# EAGLE design vfd_driver (EAGLE 7.1.0)
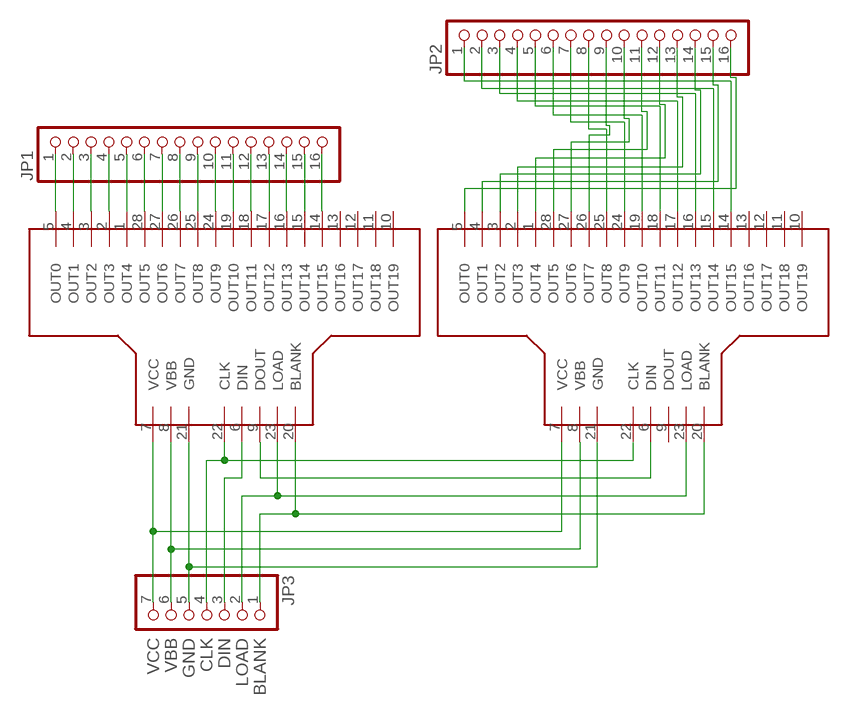
[diagram p0: schematic, sheet 1]

## Parts
JP1  PINHD-1X16  [1X16]
JP2  PINHD-1X16  [1X16]
JP3  PINHD-1X7  [1X07]
U$1  MAX6921/31  [TSSOP-28]
U$2  MAX6921/31  [TSSOP-28]

## Nets
BLANK: JP3.1 U$1.20(BLANK) U$2.20(BLANK)
CLK: JP3.4 U$1.22(CLK) U$2.22(CLK)
DIN: JP3.3 U$1.6(DIN)
DINOUT: U$1.9(DOUT) U$2.6(DIN)
GND: JP3.5 U$1.21(GND) U$2.21(GND)
LOAD: JP3.2 U$1.23(LOAD) U$2.23(LOAD)
N$1: JP2.1 U$2.14(OUT15)
N$2: JP2.2 U$2.15(OUT14)
N$3: JP2.3 U$2.16(OUT13)
N$4: JP2.4 U$2.17(OUT12)
N$5: JP2.5 U$2.18(OUT11)
N$6: JP2.6 U$2.19(OUT10)
N$7: JP2.7 U$2.24(OUT9)
N$8: JP2.8 U$2.25(OUT8)
N$9: JP2.9 U$2.26(OUT7)
N$10: JP2.10 U$2.27(OUT6)
N$11: JP2.11 U$2.28(OUT5)
N$12: JP2.12 U$2.1(OUT4)
N$13: JP2.13 U$2.2(OUT3)
N$14: JP2.14 U$2.3(OUT2)
N$15: JP2.15 U$2.4(OUT1)
N$16: JP2.16 U$2.5(OUT0)
N$33: JP1.16 U$1.14(OUT15)
N$34: JP1.15 U$1.15(OUT14)
N$35: JP1.14 U$1.16(OUT13)
N$36: JP1.13 U$1.17(OUT12)
N$37: JP1.12 U$1.18(OUT11)
N$38: JP1.11 U$1.19(OUT10)
N$39: JP1.10 U$1.24(OUT9)
N$40: JP1.9 U$1.25(OUT8)
N$41: JP1.8 U$1.26(OUT7)
N$42: JP1.7 U$1.27(OUT6)
N$43: JP1.6 U$1.28(OUT5)
N$44: JP1.5 U$1.1(OUT4)
N$45: JP1.4 U$1.2(OUT3)
N$46: JP1.3 U$1.3(OUT2)
N$47: JP1.2 U$1.4(OUT1)
N$48: JP1.1 U$1.5(OUT0)
VBB: JP3.6 U$1.8(VBB) U$2.8(VBB)
VCC: JP3.7 U$1.7(VCC) U$2.7(VCC)
Unconnected: U$1.10(OUT19) U$1.11(OUT18) U$1.12(OUT17) U$1.13(OUT16) U$2.9(DOUT) U$2.10(OUT19) U$2.11(OUT18) U$2.12(OUT17) U$2.13(OUT16)

## Notes on the sheet
- VCC | VBB | GND | CLK | DIN | LOAD | BLANK

## Library data of the parts
JP1 JP2 = pinhead:PINHD-1X16: PIN HEADER
JP3 = pinhead:PINHD-1X7: PIN HEADER
U$1 U$2 = boztalay:MAX6921/31

## Board
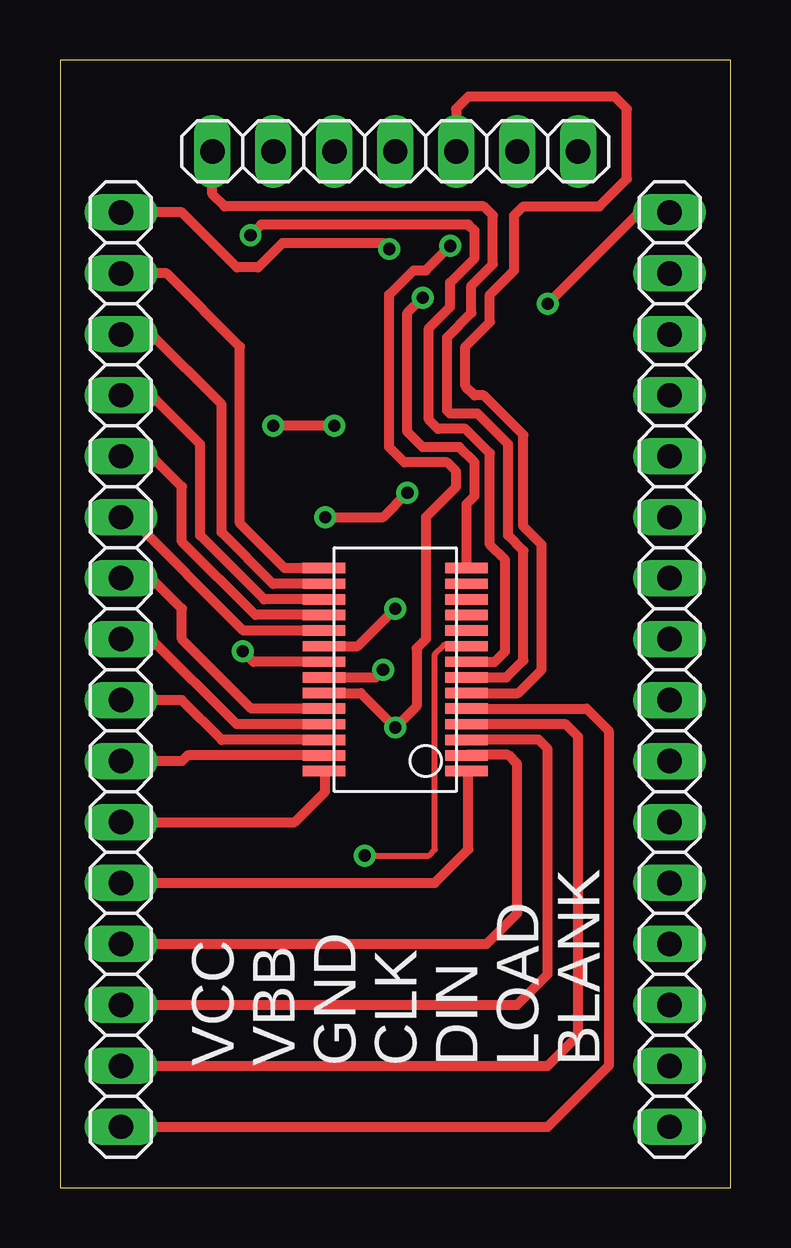
[diagram p1: board, top side]
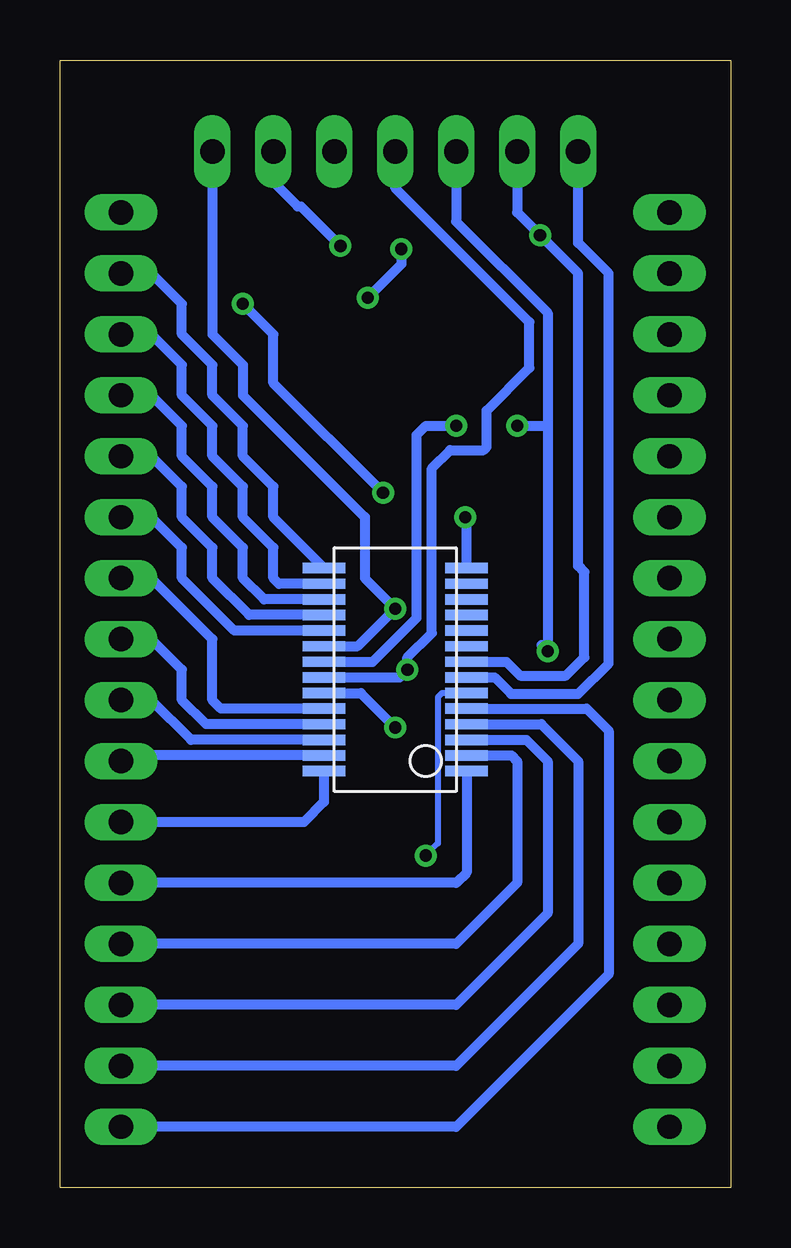
[diagram p2: board, bottom side, seen from below]

Size 27.94 x 46.99 mm. Coordinates in mm from the lower left corner, seen from the top.
Outline: 0,0 27.94,0 27.94,46.99 0,46.99 0,0
Copper layers (1*16): Top 0.035mm / dielectric 1.5mm / Bottom 0.035mm
Design rules "default *": minimum track width 10mil, minimum drill 24mil, track to track 6mil, track to pad 6mil, pad to pad 6mil, via to via 6mil, smd to smd 6mil, copper to edge 40mil, drill to drill 8mil, minimum pad ring 10mil, minimum via ring 8mil, stop-mask expansion 4mil, vias tented up to drill 0mil, thermal gap 10mil

### Footprints (pad centres in the part's own frame; a part is rotated, then mirrored left to right if it is on the bottom)
1X16 = drill 1.016 long: 1 -19.05,0; 2 -16.51,0; 3 -13.97,0; 4 -11.43,0; 5 -8.89,0; 6 -6.35,0; 7 -3.81,0; 8 -1.27,0; 9 1.27,0; 10 3.81,0; 11 6.35,0; 12 8.89,0; 13 11.43,0; 14 13.97,0; 15 16.51,0; 16 19.05,0
1X07 = drill 1.016 long: 1 -7.62,0; 2 -5.08,0; 3 -2.54,0; 4 0,0; 5 2.54,0; 6 5.08,0; 7 7.62,0
TSSOP-28 = smd 0.432 x 1.778: 1 4.227,2.972; 2 3.576,2.972; 3 2.926,2.972; 4 2.276,2.972; 5 1.626,2.972; 6 0.975,2.972; 7 0.325,2.972; 8 -0.325,2.972; 9 -0.975,2.972; 10 -1.626,2.972; 11 -2.276,2.972; 12 -2.926,2.972; 13 -3.576,2.972; 14 -4.227,2.972; 15 -4.227,-2.972; 16 -3.576,-2.972; 17 -2.926,-2.972; 18 -2.276,-2.972; 19 -1.626,-2.972; 20 -0.975,-2.972; 21 -0.325,-2.972; 22 0.325,-2.972; 23 0.975,-2.972; 24 1.626,-2.972; 25 2.276,-2.972; 26 2.926,-2.972; 27 3.576,-2.972; 28 4.227,-2.972

### Placement (x,y rotation side)
JP1  2.54,21.59 90 top
JP2  25.4,21.59 270 top
JP3  13.97,43.18 180 top
U$1  13.97,21.59 270 top
U$2  13.97,21.59 270 bottom

### Tracks (layer width: path | path; a pad name or v marks a point on that pad's centre or on a via)
BLANK  (via drill 0.51)
  Top 0.406: U$1.20 12.4,22.57 v13.97,24.13
  Bottom 0.406: U$2.20 15.54,22.57 v13.97,24.13 15.24,25.4 15.24,27.94 20.32,33.02 20.32,34.29 21.59,35.56 JP3.1
CLK  (via drill 0.51)
  Top 0.406: U$1.22 13.14,21.27 v13.46,21.59
  Bottom 0.406: U$2.22 13.79,21.27 v13.46,21.59 13.46,22.1 12.45,23.11 12.45,29.97 11.68,30.73 10.29,30.73 10.16,30.86 10.16,32.38 8.38,34.16 8.38,36.07 13.97,41.66 JP3.4
DIN
  Top 0.406: JP3.3 16.51,44.96 17.02,45.47 23.11,45.47 23.62,44.96 23.62,42.04 22.48,40.89 19.3,40.89 18.92,40.51 18.92,38.23 17.91,37.21 17.91,36.07 16.89,35.05 16.89,33.4 17.27,33.02 17.65,33.02 19.3,31.37 19.3,27.56 20.07,26.8 20.07,21.59 19.09,20.61 U$1.6
DINOUT  (via drill 0.51)
  Top 0.254: v12.7,13.84 15.37,13.84 15.62,14.1 15.62,22.23 16,22.61 16.9,22.61 U$1.9
  Bottom 0.254: U$2.6 12.02,20.61 12.19,20.45 12.19,14.35 v12.7,13.84
GND  (via drill 0.51)
  Top 0.406: U$1.21 8.06,21.91 v7.62,22.35 | v11.43,31.75 v8.89,31.75
  Bottom 0.406: 7.87,22.61 v7.62,22.35 7.62,31.75 | JP3.5 11.43,40.26 7.62,36.45 7.62,31.75 | U$2.21 14.91,21.91 13.08,23.75 13.08,31.37 12.7,31.75 v11.43,31.75 | v8.89,31.75 7.62,31.75
LOAD  (via drill 0.51)
  Top 0.406: U$1.23 12.53,20.61 v13.97,19.18 14.86,20.07 14.86,22.48 15.24,22.86 15.24,27.94 16.51,29.21 16.51,29.84 16.13,30.23 14.35,30.23 13.72,30.86 13.72,37.21 14.73,38.23 15.24,38.23 v16.26,39.24
  Bottom 0.406: U$2.23 15.41,20.61 v13.97,19.18 | JP3.2 19.05,41.91 18.03,40.89 17.91,40.89 v16.26,39.24
N$1  (via drill 0.51)
  Top 0.406: v11.05,27.94 13.46,27.94 v14.48,28.96 | v20.32,36.83 24.13,40.64 JP2.1
  Bottom 0.406: U$2.14 11,27.89 v11.05,27.94 | v14.48,28.96 19.05,33.53 19.05,35.56 v20.32,36.83
N$2
  Bottom 0.406: U$2.15 16.94,25.83 19.05,27.94 19.05,29.21 20.32,30.48 20.32,31.75 21.59,33.02 21.59,34.29 22.86,35.56 22.86,36.83 24.13,38.1 JP2.2
N$3
  Bottom 0.406: JP2.3 24.13,35.56 22.86,34.29 22.86,33.02 21.59,31.75 21.59,30.48 20.32,29.21 20.32,27.94 19.05,26.67 19.05,25.4 18.82,25.17 U$2.16
N$4
  Bottom 0.406: JP2.4 24.13,33.02 22.86,31.75 22.86,30.48 21.59,29.21 21.59,27.94 20.32,26.67 20.32,25.4 19.44,24.52 U$2.17
N$5
  Bottom 0.406: U$2.18 20.06,23.87 21.59,25.4 21.59,26.67 22.86,27.94 22.86,29.21 24.13,30.48 JP2.5
N$6
  Bottom 0.406: U$2.19 20.68,23.22 22.86,25.4 22.86,26.67 24.13,27.94 JP2.6
N$7
  Bottom 0.406: U$2.24 21.23,19.96 21.59,20.32 21.59,22.86 24.13,25.4 JP2.7
N$8
  Bottom 0.406: U$2.25 21.85,19.31 22.86,20.32 22.86,21.59 24.13,22.86 JP2.8
N$9
  Bottom 0.406: U$2.26 22.47,18.66 24.13,20.32 JP2.9
N$10
  Bottom 0.406: U$2.27 25.17,18.01 JP2.10
N$11
  Bottom 0.406: U$2.28 16.94,16.08 17.78,15.24 JP2.11
N$12
  Bottom 0.406: U$2.1 11,13.13 11.43,12.7 JP2.12
N$13
  Bottom 0.406: U$2.2 9.12,18.01 8.89,17.78 8.89,12.7 11.43,10.16 JP2.13
N$14
  Bottom 0.406: U$2.3 8.5,18.66 7.62,17.78 7.62,11.43 11.43,7.62 JP2.14
N$15
  Bottom 0.406: U$2.4 7.88,19.31 6.35,17.78 6.35,10.16 11.43,5.08 JP2.15
N$16
  Bottom 0.406: U$2.5 5.99,19.96 5.08,19.05 5.08,8.89 11.43,2.54 JP2.16
N$33  (via drill 0.51)
  Top 0.406: U$1.14 16.94,28.5 17.27,28.83 17.27,30.23 16.64,30.86 15.11,30.86 14.48,31.5 14.48,36.45 v15.11,37.08 | JP1.16 5.08,40.64 7.37,38.35 8.26,38.35 9.27,39.37 13.46,39.37 v13.72,39.12
  Bottom 0.406: v13.72,39.12 13.72,38.48 v15.11,37.08
N$34
  Top 0.406: U$1.15 9.36,25.82 7.49,27.69 7.49,35.05 4.45,38.1 JP1.15
N$35
  Top 0.406: U$1.16 8.87,25.17 6.73,27.3 6.73,32.64 3.81,35.56 JP1.14
N$36
  Top 0.406: U$1.17 8.5,24.52 5.84,27.18 5.84,30.99 3.81,33.02 JP1.13
N$37
  Top 0.406: U$1.18 8.14,23.87 5.08,26.92 5.08,29.21 3.81,30.48 JP1.12
N$38
  Top 0.406: U$1.19 7.64,23.22 2.92,27.94 JP1.11
N$39
  Top 0.406: U$1.24 7.98,19.96 5.08,22.86 5.08,24.13 3.81,25.4 JP1.10
N$40
  Top 0.406: U$1.25 7.36,19.31 3.81,22.86 JP1.9
N$41
  Top 0.406: U$1.26 6.74,18.66 5.08,20.32 JP1.8
N$42
  Top 0.406: U$1.27 5.31,18.01 5.08,17.78 JP1.7
N$43
  Top 0.406: JP1.6 9.78,15.24 11.05,16.51 11.05,17.31 U$1.28
N$44
  Top 0.406: JP1.5 15.62,12.7 17.02,14.1 17.02,17.29 U$1.1
N$45
  Top 0.406: JP1.4 17.78,10.16 19.05,11.43 19.05,17.65 18.67,18.03 16.96,18.03 U$1.2
N$46
  Top 0.406: JP1.3 19.05,7.62 20.32,8.89 20.32,18.29 19.94,18.67 U$1.3
N$47
  Top 0.406: JP1.2 20.32,5.08 21.59,6.35 21.59,18.8 21.08,19.3 16.95,19.3 U$1.4
N$48
  Top 0.406: JP1.1 20.32,2.54 22.86,5.08 22.86,19.05 21.95,19.96 U$1.5
VBB  (via drill 0.51)
  Top 0.406: v7.94,39.69 8.38,40.13 17.02,40.13 17.27,39.88 17.27,38.73 16.26,37.72 16.26,36.7 15.37,35.81 15.37,32 15.75,31.62 16.89,31.62 17.91,30.61 17.91,26.8 18.54,26.16 18.54,22.35 18.11,21.91 U$1.8
  Bottom 0.406: JP3.6 8.89,40.64 v7.94,39.69 6.35,38.1 6.35,25.91 6.1,25.65 6.1,22.1 6.86,21.34 8.76,21.34 9.34,21.91 U$2.8
VCC
  Top 0.406: JP3.7 6.35,41.4 6.86,40.89 17.65,40.89 18.03,40.51 18.03,38.48 17.14,37.59 17.14,36.45 16.13,35.43 16.13,32.38 16.26,32.26 17.4,32.26 18.67,30.99 18.67,27.18 19.3,26.54 19.3,21.97 18.6,21.27 U$1.7
  Bottom 0.406: JP3.7 6.35,39.37 5.08,38.1 5.08,21.84 6.35,20.57 9.14,20.57 9.84,21.27 U$2.7

### Text on the board
tNames: VCC | VBB | GND | CLK | DIN | LOAD | BLANK